# Altium schematic sheet MainSheet.SchDoc
size A4
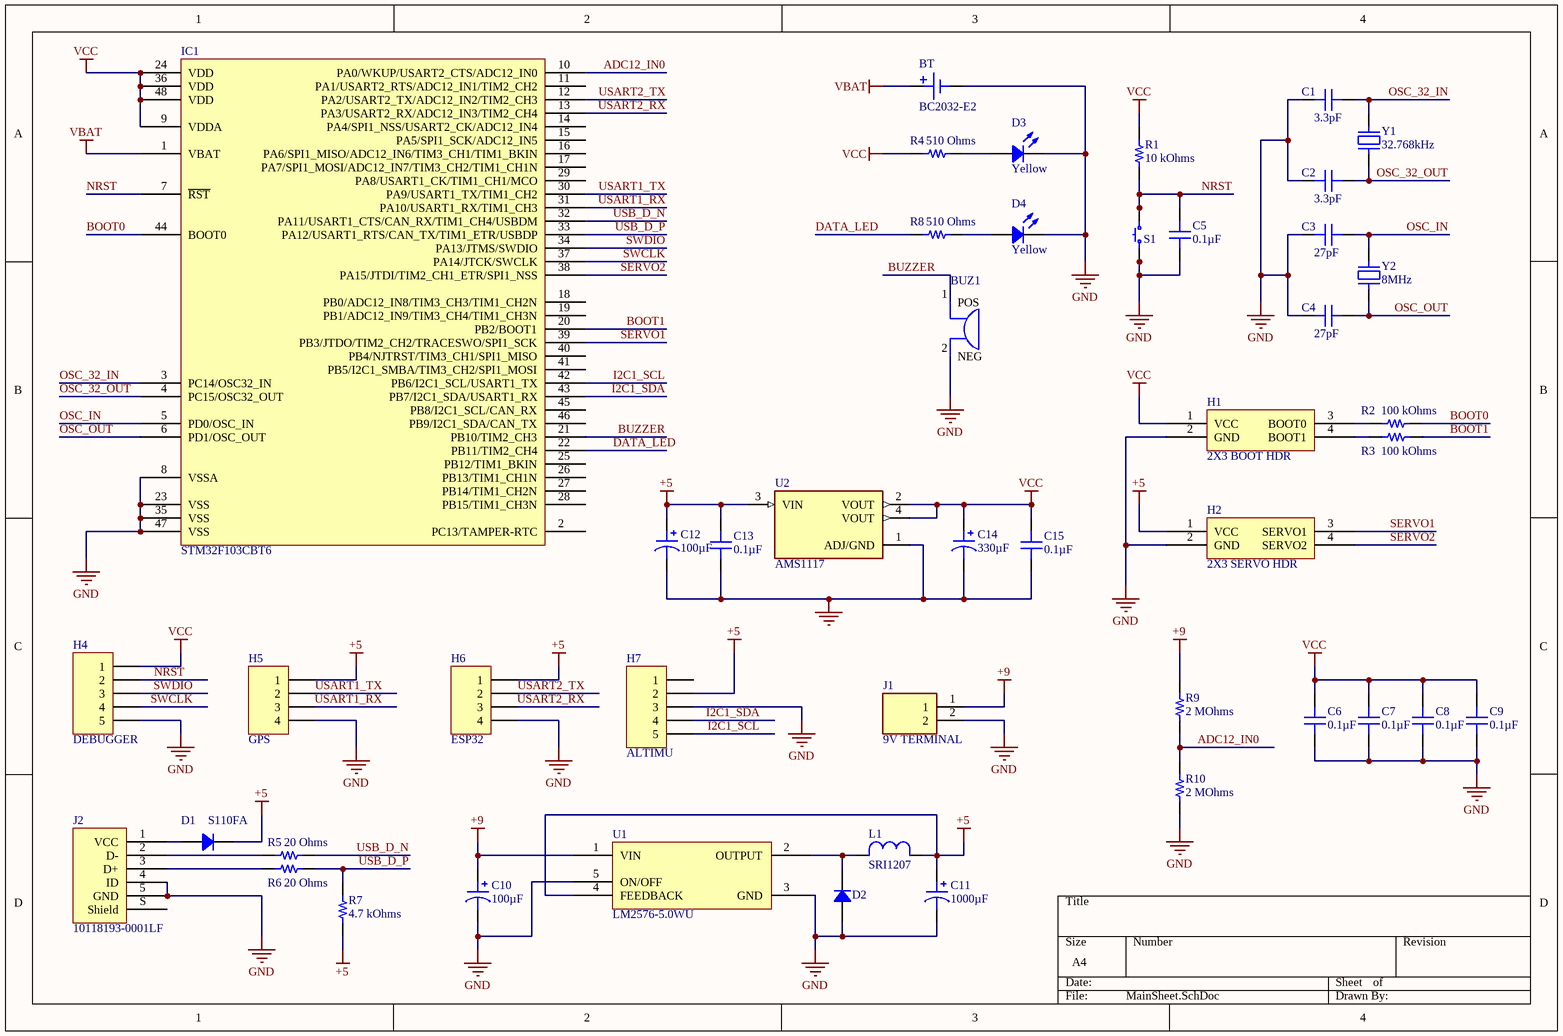
[diagram p0: MainSheet.SchDoc]

## Parts
BT  BC2032-E2  [MPD_BC2032-E2]
BUZ1  MCKPM-G1201A-K4037  [XDCR_MCKPM-G1201A-K4037]  (value not drawn)
C1  3.3pF  [CAP 0603_1608]
C2  3.3pF  [CAP 0603_1608]
C3  27pF  [CAP 0603_1608]
C4  27pF  [CAP 0603_1608]
C5  0.1µF  [CAP 0603_1608]
C6  0.1µF  [CAP 0603_1608]
C7  0.1µF  [CAP 0603_1608]
C8  0.1µF  [CAP 0603_1608]
C9  0.1µF  [CAP 0603_1608]
C10  100µF  [CAP POL 2917_7343]
C11  1000µF  [CAP POL 2917_7343]
C12  100µF  [CAP POL 2917_7343]
C13  0.1µF  [CAP 0805_2012]
C14  330µF  [CAP POL 2917_7343]
C15  0.1µF  [CAP 0805_2012]
D1  S110FA  [SOD-123W]
D2  B360Q-13-F  [DO214AB SMC]  (value not drawn)
D3  Yellow  [LED 1206_3216 YELLOW]
D4  Yellow  [LED 1206_3216 YELLOW]
H1  2X3 BOOT HDR  [2x3 Male Header]
H2  2X3 SERVO HDR  [2x3 Male Header]
H4  DEBUGGER  [HDR1X5]
H5  GPS  [HDR1X4]
H6  ESP32  [HDR1X4]
H7  ALTIMU  [HDR1X5]
IC1  STM32F103CBT6  [ST LQFP-48 7X7MM]
J1  9V TERMINAL  [TE_796683-2]
J2  10118193-0001LF  [FCI USB 10118193-0001LF]
L1  SRI1207  [PCBComponent_1]
R1  10 kOhms  [RES 0603_1608]
R2  100 kOhms  [RES 0603_1608]
R3  100 kOhms  [RES 0603_1608]
R4  510 Ohms  [RES 1206_3216]
R5  20 Ohms  [RES 0603_1608]
R6  20 Ohms  [RES 0603_1608]
R7  4.7 kOhms  [RES 0603_1608]
R8  510 Ohms  [RES 1206_3216]
R9  2 MOhms  [RES 1206_3216]
R10  2 MOhms  [RES 1206_3216]
S1  FSM4JSMATR  [TE FSM4JSMA]  (value not drawn)
U1  LM2576-5.0WU  [DPAK6P170_1524X459L254X81N]
U2  AMS1117  [SOT229P700X180-4N]
Y1  32.768kHz  [ABRACON ABS07]
Y2  8MHz  [ABRACON ABLS]

## Nets
+5: C11.1 C12.1 C13.2 D1.2 H2.1(VCC) H5.1 H6.1 H7.2 L1.2 R7.1 U1.4(FEEDBACK) U2.3(VIN)
+9: C10.1 J1.1 R9.2 U1.1(VIN)
GND: BT.N BUZ1.2(NEG) C1.1 C2.1 C3.2 C4.2 C5.1 C6.1 C7.1 C8.1 C9.1 C10.2 C11.2 C12.2 C13.1 C14.2 C15.1 D2.1 D3.2 D4.2 H1.2(GND) H2.2(GND) H4.5 H5.4 H6.4 H7.3 IC1.8(VSSA) IC1.23(VSS) IC1.35(VSS) IC1.47(VSS) J1.2 J2.4(ID) J2.5(GND) R10.1 S1.1 S1.2 U1.3(GND) U1.5(ON/OFF) U2.1(ADJ/GND)
VBAT: BT.P IC1.1(VBAT)
VCC: C6.2 C7.2 C8.2 C9.2 C14.1 C15.2 H1.1(VCC) H4.1 IC1.9(VDDA) IC1.24(VDD) IC1.36(VDD) IC1.48(VDD) R1.2 R4.1 U2.2(VOUT) U2.4(VOUT)
ADC12_IN0: IC1.10(PA0/WKUP/USART2_CTS/ADC12_IN0) R9.1 R10.2
BOOT0: IC1.44(BOOT0) R2.2
BOOT1: IC1.20(PB2/BOOT1) R3.2
BUZZER: BUZ1.1(POS) IC1.21(PB10/TIM2_CH3)
DATA_LED: IC1.22(PB11/TIM2_CH4) R8.1
I2C1_SCL: H7.5 IC1.42(PB6/I2C1_SCL/USART1_TX)
I2C1_SDA: H7.4 IC1.43(PB7/I2C1_SDA/USART1_RX)
NRST: C5.2 H4.2 IC1.7(~{RST}) R1.1 S1.3 S1.4
OSC_32_IN: C1.2 IC1.3(PC14/OSC32_IN) Y1.2
OSC_32_OUT: C2.2 IC1.4(PC15/OSC32_OUT) Y1.1
OSC_IN: C3.1 IC1.5(PD0/OSC_IN) Y2.2
OSC_OUT: C4.1 IC1.6(PD1/OSC_OUT) Y2.1
SERVO1: H2.3(SERVO1) IC1.39(PB3/JTDO/TIM2_CH2/TRACESWO/SPI1_SCK)
SERVO2: H2.4(SERVO2) IC1.38(PA15/JTDI/TIM2_CH1_ETR/SPI1_NSS)
SWCLK: H4.4 IC1.37(PA14/JTCK/SWCLK)
SWDIO: H4.3 IC1.34(PA13/JTMS/SWDIO)
USART1_RX: H5.3 IC1.31(PA10/USART1_RX/TIM1_CH3)
USART1_TX: H5.2 IC1.30(PA9/USART1_TX/TIM1_CH2)
USART2_RX: H6.3 IC1.13(PA3/USART2_RX/ADC12_IN3/TIM2_CH4)
USART2_TX: H6.2 IC1.12(PA2/USART2_TX/ADC12_IN2/TIM2_CH3)
USB_D_N: IC1.32(PA11/USART1_CTS/CAN_RX/TIM1_CH4/USBDM) R5.2
USB_D_P: IC1.33(PA12/USART1_RTS/CAN_TX/TIM1_ETR/USBDP) R6.2 R7.2
NetD1_1: D1.1 J2.1(VCC)
NetD2_2: D2.2 L1.1 U1.2(OUTPUT)
NetD3_1: D3.1 R4.2
NetD4_1: D4.1 R8.2
NetH1_3: H1.3(BOOT0) R2.1
NetH1_4: H1.4(BOOT1) R3.1
NetJ2_2: J2.2(D-) R5.1
NetJ2_3: J2.3(D+) R6.1

Not connected (* = marked no-connect by the designer): H7 1; IC1 2(PC13/TAMPER-RTC) 11(PA1/USART2_RTS/ADC12_IN1/TIM2_CH2) 14(PA4/SPI1_NSS/USART2_CK/ADC12_IN4) 15(PA5/SPI1_SCK/ADC12_IN5) 16(PA6/SPI1_MISO/ADC12_IN6/TIM3_CH1/TIM1_BKIN) 17(PA7/SPI1_MOSI/ADC12_IN7/TIM3_CH2/TIM1_CH1N) 18(PB0/ADC12_IN8/TIM3_CH3/TIM1_CH2N) 19(PB1/ADC12_IN9/TIM3_CH4/TIM1_CH3N) 25(PB12/TIM1_BKIN) 26(PB13/TIM1_CH1N) 27(PB14/TIM1_CH2N) 28(PB15/TIM1_CH3N) 29(PA8/USART1_CK/TIM1_CH1/MCO) 40(PB4/NJTRST/TIM3_CH1/SPI1_MISO) 41(PB5/I2C1_SMBA/TIM3_CH2/SPI1_MOSI) 45(PB8/I2C1_SCL/CAN_RX) 46(PB9/I2C1_SDA/CAN_TX); J2 S(Shield)

## Library data of the parts
BT = BC2032-E2: BATTERY HOLDER COIN 20MM PC PIN; MF: MPD _Memory; Package: None; Value: *; Price: None; MP: BC2032-E2; Availability: Unavailable; SnapEDA_Link: https://www.snapeda.com/parts/BC2032-E2/MPD%20%28Memory%20Protection%20Devices%29/view-part/4219598/?ref=snap
BUZ1 = MCKPM-G1201A-K4037: Magnetic Buzzer & Transducer MCKPM-G1201A-K4037 /; MF: Multicomp; Value: *; SnapEDA_Link: https://www.snapeda.com/parts/MCKPM-G1201A-K4037/Multicomp/view-part/231709/?ref=snap; Package: None; MP: MCKPM-G1201A-K4037; Availability: Unavailable; Price: None
C1 C2 = 06035U3R3CAT2A: CAP CER 3.3PF 50V NP0 0603; Manufacturer: AVX Corporation; Temperature Coefficient: C0G, NP0; Tolerance: ±0.25pF; Part Number: 06035U3R3CAT2A; Value: 3.3pF; Applications: RF, Microwave, High Frequency; Capacitance: 3.3pF; ComponentLink1Description: Datasheet; ComponentLink1URL: http://datasheets.avx.com/U-Series.pdf; ComponentLink2Description: DigiKey Link; ComponentLink2URL: http://digikey.com/product-detail/en/avx-corporation/06035U3R3CAT2A/478-12739-1-ND/9949267; Device Package: 0603 (1608 Metric); Features: Ultra Low ESR; LastUpdated: 2.09.2020 01:03:19; Lifecycle Status: Active; Minimum Order: 1; Mounting Type: Surface Mount, MLCC; Operating Temperature: -55°C ~ 125°C; Package / Case: 0603 (1608 Metric); Packaging: TapeAndReel; PartId: 11763; Part Status: Active; Price: 0.06; Series: U; Size / Dimension: 0.060" L x 0.030" W (1.52mm x 0.76mm); Supplier 1: DigiKey; Supplier Part Number 1: 478-12739-1-ND; Thickness (Max): 0.036" (0.91mm); Voltage - Rated: 50V
C3 C4 = 600S270FW250XT: CAP CER 27PF 250V NP0 0603; Manufacturer: American Technical Ceramics; Temperature Coefficient: C0G, NP0; Tolerance: ±1%; Part Number: 600S270FW250XT; Value: 27pF; Applications: RF, Microwave, High Frequency, Bypass, Decoupling; Capacitance: 27pF; ComponentLink1Description: Datasheet; ComponentLink1URL: http://www.atceramics.com/UserFiles/600s.pdf; ComponentLink2Description: DigiKey Link; ComponentLink2URL: http://digikey.com/product-detail/en/american-technical-ceramics/600S270FW250XT/1284-1876-1-ND/8269410; Device Package: 0603 (1608 Metric); Features: High Q, Low Loss, Ultra Low ESR; LastUpdated: 2.09.2020 01:03:27; Lifecycle Status: Active; Minimum Order: 1; Mounting Type: Surface Mount, MLCC; Operating Temperature: -55°C ~ 125°C; Package / Case: 0603 (1608 Metric); Packaging: TapeAndReel; PartId: 7201; Part Status: Active; Price: 0.49; Series: ATC 600S; Size / Dimension: 0.063" L x 0.032" W (1.60mm x 0.81mm); Supplier 1: DigiKey; Supplier Part Number 1: 1284-1876-1-ND; Thickness (Max): 0.035" (0.89mm); Voltage - Rated: 250V
C5-C9 = 885012206071: CAP CER 0.1UF 25V X7R 0603; Manufacturer: Würth Elektronik; Tolerance: ±10%; Part Number: 885012206071; Value: 0.1µF; Applications: General Purpose; Capacitance: 0.1µF; ComponentLink1Description: Datasheet; ComponentLink1URL: https://katalog.we-online.de/pbs/datasheet/885012206071.pdf; ComponentLink2Description: DigiKey Link; ComponentLink2URL: http://digikey.com/product-detail/en/w-rth-elektronik/885012206071/732-7989-1-ND/5454616; Device Package: 0603 (1608 Metric); LastUpdated: 2.09.2020 01:03:30; Lifecycle Status: Active; Minimum Order: 1; Mounting Type: Surface Mount, MLCC; Operating Temperature: -55°C ~ 125°C; Package / Case: 0603 (1608 Metric); Packaging: TapeAndReel; PartId: 5665; Part Status: Active; Price: 0.02; Series: WCAP-CSGP; Size / Dimension: 0.063" L x 0.031" W (1.60mm x 0.80mm); Supplier 1: DigiKey; Supplier Part Number 1: 732-7989-1-ND; Temperature Coefficient: X7R; Thickness (Max): 0.037" (0.95mm); Voltage - Rated: 25V
C10 = T495X107K016ATE080: CAP TANT 100UF 10% 16V 2917; Manufacturer: KEMET; Manufacturer Size Code: X; ESR (Equivalent Series Resistance): 80mOhm; Lifetime @ Temp.: 2000 Hrs @ 85°C; Type: Molded; Part Number: T495X107K016ATE080; Value: 100µF; Capacitance: 100µF; ComponentLink1Description: Datasheet; ComponentLink1URL: https://api.kemet.com/component-edge/download/datasheet/T495X107K016ATE080.pdf; ComponentLink2Description: DigiKey Link; ComponentLink2URL: http://digikey.com/product-detail/en/kemet/T495X107K016ATE080/399-10399-1-ND/3880218; Device Package: 2917 (7343 Metric); Features: General Purpose; Height - Seated (Max): 0.169" (4.30mm); LastUpdated: 2.09.2020 01:16:13; Lifecycle Status: Active; Minimum Order: 1; Mounting Type: Surface Mount; Operating Temperature: -55°C ~ 125°C; Package / Case: 2917 (7343 Metric); Packaging: TapeAndReel; PartId: 2918; Part Status: Active; Price: 1.26; Series: T495; Size / Dimension: 0.287" L x 0.169" W (7.30mm x 4.30mm); Supplier 1: DigiKey; Supplier Part Number 1: 399-10399-1-ND; Tolerance: ±10%; Voltage - Rated: 16V
C11 = T491X108K006AT: CAP TANT 1000UF 10% 6.3V 2917; Manufacturer: KEMET; Manufacturer Size Code: X; ESR (Equivalent Series Resistance): 600mOhm; Lifetime @ Temp.: 2000 Hrs @ 125°C; Type: Molded; Part Number: T491X108K006AT; Value: 1000µF; Capacitance: 1000µF; ComponentLink1Description: Datasheet; ComponentLink1URL: https://api.kemet.com/component-edge/download/datasheet/T491X108K006AT.pdf; ComponentLink2Description: DigiKey Link; ComponentLink2URL: http://digikey.com/product-detail/en/kemet/T491X108K006AT/399-5123-1-ND/1681767; Device Package: 2917 (7343 Metric); Features: General Purpose; Height - Seated (Max): 0.169" (4.30mm); LastUpdated: 2.09.2020 01:16:11; Lifecycle Status: Active; Minimum Order: 1; Mounting Type: Surface Mount; Operating Temperature: -55°C ~ 125°C; Package / Case: 2917 (7343 Metric); Packaging: TapeAndReel; PartId: 3349; Part Status: Active; Price: 2.10; Series: T491; Size / Dimension: 0.287" L x 0.169" W (7.30mm x 4.30mm); Supplier 1: DigiKey; Supplier Part Number 1: 399-5123-1-ND; Tolerance: ±10%; Voltage - Rated: 6.3V
C12 = TR3D107K020C0080: CAP TANT 100UF 10% 20V 2917; Manufacturer: Vishay Sprague; Manufacturer Size Code: D; ESR (Equivalent Series Resistance): 80mOhm; Type: Molded; Part Number: TR3D107K020C0080; Value: 100µF; Capacitance: 100µF; ComponentLink1Description: Datasheet; ComponentLink1URL: http://www.vishay.com/docs/40080/tr3.pdf; ComponentLink2Description: DigiKey Link; ComponentLink2URL: http://digikey.com/product-detail/en/vishay-sprague/TR3D107K020C0080/718-1774-1-ND/2260028; Device Package: 2917 (7343 Metric); Features: General Purpose; Height - Seated (Max): 0.122" (3.10mm); LastUpdated: 2.09.2020 01:16:12; Lifecycle Status: Active; Minimum Order: 1; Mounting Type: Surface Mount; Operating Temperature: -55°C ~ 125°C; Package / Case: 2917 (7343 Metric); Packaging: TapeAndReel; PartId: 3089; Part Status: Active; Price: 0.61; Series: TANTAMOUNT®, TR3; Size / Dimension: 0.287" L x 0.169" W (7.30mm x 4.30mm); Supplier 1: DigiKey; Supplier Part Number 1: 718-1774-1-ND; Tolerance: ±10%; Voltage - Rated: 20V
C13 C15 = AC0805KKX8R9BB104: CAP CER 0805 10% X8R 50V 100NF; Manufacturer: Yageo; Part Number: AC0805KKX8R9BB104; Value: 0.1µF; Applications: Automotive; Capacitance: 0.1µF; ComponentLink1Description: Datasheet; ComponentLink1URL: http://www.yageo.com/documents/recent/AC0805KKX8R9BB104.pdf; ComponentLink2Description: DigiKey Link; ComponentLink2URL: http://digikey.com/product-detail/en/yageo/AC0805KKX8R9BB104/311-4624-1-ND/9699550; Device Package: 0805 (2012 Metric); LastUpdated: 2.09.2020 01:04:20; Lifecycle Status: Active; Minimum Order: 1; Mounting Type: Surface Mount, MLCC; Operating Temperature: -55°C ~ 150°C; Package / Case: 0805 (2012 Metric); Packaging: TapeAndReel; PartId: 14076; Part Status: Active; Price: 0.06; Ratings: AEC-Q200; Series: AC; Size / Dimension: 0.079" L x 0.049" W (2.00mm x 1.25mm); Supplier 1: DigiKey; Supplier Part Number 1: 311-4624-1-ND; Temperature Coefficient: X8R; Thickness (Max): 0.057" (1.45mm); Tolerance: ±10%; Voltage - Rated: 50V
C14 = T494D337K006AT: CAP TANT 330UF 10% 6.3V 2917; Manufacturer: KEMET; Manufacturer Size Code: D; ESR (Equivalent Series Resistance): 150mOhm; Lifetime @ Temp.: 2000 Hrs @ 125°C; Type: Molded; Part Number: T494D337K006AT; Value: 330µF; Capacitance: 330µF; ComponentLink1Description: Datasheet; ComponentLink1URL: https://api.kemet.com/component-edge/download/datasheet/T494D337K006AT.pdf; ComponentLink2Description: DigiKey Link; ComponentLink2URL: http://digikey.com/product-detail/en/kemet/T494D337K006AT/399-10434-1-ND/3907839; Device Package: 2917 (7343 Metric); Features: General Purpose; Height - Seated (Max): 0.122" (3.10mm); LastUpdated: 2.09.2020 01:16:17; Lifecycle Status: Active; Minimum Order: 1; Mounting Type: Surface Mount; Operating Temperature: -55°C ~ 125°C; Package / Case: 2917 (7343 Metric); Packaging: TapeAndReel; PartId: 2266; Part Status: Active; Price: 2.20; Series: T494; Size / Dimension: 0.287" L x 0.169" W (7.30mm x 4.30mm); Supplier 1: DigiKey; Supplier Part Number 1: 399-10434-1-ND; Tolerance: ±10%; Voltage - Rated: 6.3V
D1 = S110FA: DIODE SCHOTTKY 100V 1A SOD123FA; Manufacturer: ON Semiconductor; Capacitance @ Vr, F: 55pF @ 4V, 1MHz; Current - Reverse Leakage @ Vr: 50µA @ 100V; Speed: Fast Recovery =< 500ns, > 200mA (Io); Voltage - Forward (Vf) (Max) @ If: 800mV @ 1A; Part Number: S110FA; ComponentLink1Description: Datasheet; ComponentLink1URL: https://www.onsemi.com/pub/Collateral/S110FA-D.pdf; ComponentLink2Description: DigiKey Link; ComponentLink2URL: http://digikey.com/product-detail/en/on-semiconductor/S110FA/S110FACT-ND/5892121; Current - Average Rectified (Io): 1A; Diode Type: Schottky; LastUpdated: 2.09.2020 01:30:30; Lifecycle Status: Active; Minimum Order: 1; Mounting Type: Surface Mount; Operating Temperature - Junction: -55°C ~ 150°C; Package / Case: SOD-123W; Packaging: TapeAndReel; PartId: 3121; Part Status: Active; Price: 0.07; Series: Automotive, AEC-Q101; Supplier 1: DigiKey; Supplier Part Number 1: S110FACT-ND; Supplier Device Package: SOD-123FA; Voltage - DC Reverse (Vr) (Max): 100V
D2 = B360Q-13-F: DIODE SCHOTTKY 60V 3A SMC; Manufacturer: Diodes Incorporated; Capacitance @ Vr, F: 200pF @ 4V, 1MHz; Current - Reverse Leakage @ Vr: 500µA @ 60V; Speed: Fast Recovery =< 500ns, > 200mA (Io); Voltage - Forward (Vf) (Max) @ If: 700mV @ 3A; Part Number: B360Q-13-F; ComponentLink1Description: Datasheet; ComponentLink1URL: https://www.diodes.com/assets/Datasheets/B320Q-B360Q.pdf; ComponentLink2Description: DigiKey Link; ComponentLink2URL: http://digikey.com/product-detail/en/diodes-incorporated/B360Q-13-F/B360Q-13-FDICT-ND/6012769; Current - Average Rectified (Io): 3A; Diode Type: Schottky; LastUpdated: 2.09.2020 01:18:57; Lifecycle Status: Active; Minimum Order: 1; Mounting Type: Surface Mount; Operating Temperature - Junction: -55°C ~ 150°C; Package / Case: DO-214AB, SMC; Packaging: TapeAndReel; PartId: 1652; Part Status: Active; Price: 0.16; Series: Automotive, AEC-Q101; Supplier 1: DigiKey; Supplier Part Number 1: B360Q-13-FDICT-ND; Supplier Device Package: SMC; Voltage - DC Reverse (Vr) (Max): 60V
D3 D4 = FKY1105W-TR: LED YELLOW CLEAR SMD; Manufacturer: Stanley Electric Co; Configuration: Standard; Current - Test: 20mA; Lens Color: Colorless; Lens Size: 1.60mm Dia; Lens Style: Round with Domed Top; Millicandela Rating: 2850mcd; Voltage - Forward (Vf) (Typ): 2.2V; Wavelength - Dominant: 589nm; Wavelength - Peak: 595nm; Part Number: FKY1105W-TR; Color: Yellow; ComponentLink1Description: Datasheet; ComponentLink1URL: http://www.stanley-components.com/php/downloaddatafile.php?rp=0,FKY1105W-TR_e.pdf; ComponentLink2Description: DigiKey Link; ComponentLink2URL: http://digikey.com/product-detail/en/stanley-electric-co/FKY1105W-TR/404-1272-1-ND/9477277; Device Package: 1206 (3216 Metric); Height (Max): 2.05mm; LastUpdated: 2.09.2020 01:21:25; Lens Transparency: Clear; Lifecycle Status: Active; Minimum Order: 1; Mounting Type: Surface Mount; Package / Case: 1206 (3216 Metric); Packaging: TapeAndReel; PartId: 35; Part Status: Active; Price: 0.14; Series: 1105W; Size / Dimension: 3.20mm L x 1.60mm W; Supplier 1: DigiKey; Supplier Part Number 1: 404-1272-1-ND; Supplier Device Package: 3216 (1206); Value: Yellow
H1 H2 = 2X3 BOOT HDR: 2x3 2.54mm Male Header
H4 H7 = Header 5: 1x5 2.54mm Male Header; LatestRevisionDate: 17-Jul-2002; LatestRevisionNote: Re-released for DXP Platform.; Publisher: Altium Limited
H5 H6 = Header 4: 1x4 2.54mm Male Header; LatestRevisionDate: 17-Jul-2002; LatestRevisionNote: Re-released for DXP Platform.; Publisher: Altium Limited
IC1 = STM32F103CBT6: IC MCU 32BIT 128KB FLASH 48LQFP; Manufacturer: STMicroelectronics; Connectivity: CANbus, I²C, IrDA, LINbus, SPI, UART/USART, USB; Core Processor: ARM® Cortex®-M3; Core Size: 32-Bit; Data Converters: A/D 10x12b; Number of I/O: 37; Oscillator Type: Internal; Peripherals: DMA, Motor Control PWM, PDR, POR, PVD, PWM, Temp Sensor, WDT; Program Memory Size: 128KB (128K x 8); RAM Size: 20K x 8; Speed: 72MHz; Voltage - Supply (Vcc/Vdd): 2V ~ 3.6V; Part Number: STM32F103CBT6; ComponentLink1Description: Datasheet; ComponentLink1URL: https://www.st.com/resource/en/datasheet/stm32f103cb.pdf; ComponentLink2Description: DigiKey Link; ComponentLink2URL: http://digikey.com/product-detail/en/stmicroelectronics/STM32F103CBT6/497-6288-ND/1754420; Device Package: 48-LQFP; LastUpdated: 24.05.2020 22:49:18; Lifecycle Status: Active; Minimum Order: 1; Mounting Type: Surface Mount; Operating Temperature: -40°C ~ 85°C (TA); Package / Case: 48-LQFP; Packaging: Tray; PartId: 194; Part Status: Active; Price: 5.25; Program Memory Type: FLASH; Series: STM32F1; Supplier 1: DigiKey; Supplier Part Number 1: 497-6288-ND
J1 = 796683-2: Wire to Board 2 Position 5 mm Pitch 30-12 AWG Euro Style Terminal Block; MF: TE Connectivity; SnapEDA_Link: https://www.snapeda.com/parts/796683-2/TE%20Connectivity/view-part/2873073/?ref=snap; Availability: Unavailable; Price: None; Package: None; TE_purchase_URL: https://www.te.com/usa-en/product-796683-2.html?te_bu=Cor&te_type=disp&te_campaign=seda_glo_cor-seda-global-disp-prtnr-fy19-seda-model-bom-cta_sma-317_1&elqCampaignId=32493; MP: 796683-2; Value: *
J2 = 10118193-0001LF: CONN RCPT USB2.0 MICRO B SMD R/A; Manufacturer: Amphenol ICC (FCI); Connector Type: USB - micro B; Current Rating (Amps): 1.8A per Contact; Gender: Receptacle; Mating Cycles: 10000; Number of Contacts: 5; Number of Ports: 1; Shielding: Shielded; Voltage - Rated: 100VAC; Part Number: 10118193-0001LF; ComponentLink1Description: Datasheet; ComponentLink1URL: https://cdn.amphenol-icc.com/media/wysiwyg/files/documentation/datasheet/inputoutput/io_usb_micro.pdf; ComponentLink2Description: DigiKey Link; ComponentLink2URL: //digikey.com/product-detail/en/amphenol-icc-fci/10118193-0001LF/609-4616-2-ND/2785388; Features: Solder Retention; LastUpdated: 9.12.2019 20:51:28; Lifecycle Status: 0; Minimum Order: 1; Mounting Feature: Horizontal; Mounting Type: Surface Mount, Right Angle; Through Hole; Operating Temperature: -30°C ~ 80°C; Packaging: TapeAndReel; Part Status: Active; Price: 0.21; Series: -; Specifications: USB 2.0; Supplier 1: DigiKey; Supplier Part Number 1: 609-4616-2-ND; Termination: Solder
R1 = RS73F1JTTD1002B: RES 10K OHM 0.1% 1/5W 0603; Manufacturer: KOA Speer Electronics, Inc.; Power (Watts): 0.2W, 1/5W; Temperature Coefficient: ±25ppm/°C; Part Number: RS73F1JTTD1002B; Value: 10 kOhms; ComponentLink1Description: Datasheet; ComponentLink1URL: http://www.koaspeer.com/pdfs/RS73.pdf; ComponentLink2Description: DigiKey Link; ComponentLink2URL: http://digikey.com/product-detail/en/koa-speer-electronics-inc/RS73F1JTTD1002B/2019-RS73F1JTTD1002BCT-ND/11594458; Composition: Thick Film; Device Package: 0603 (1608 Metric); Features: Automotive AEC-Q200, Moisture Resistant; LastUpdated: 2.09.2020 01:09:22; Lifecycle Status: Active; Minimum Order: 1; Number of Terminations: 2; Operating Temperature: -55°C ~ 155°C; Package / Case: 0603 (1608 Metric); Packaging: Unknown; PartId: 56378; Part Status: Active; Price: 0.08; Ratings: AEC-Q200; Resistance: 10 kOhms; Series: RS73; Supplier 1: DigiKey; Supplier Part Number 1: 2019-RS73F1JTTD1002BCT-ND; Supplier Device Package: 0603; Tolerance: ±0.1%
R2 R3 = MCT06030D1003DP500: RES SMD 100K OHM 0.5% 1/8W 0603; Manufacturer: Vishay Beyschlag; Power (Watts): 0.125W, 1/8W; Temperature Coefficient: ±25ppm/°C; Part Number: MCT06030D1003DP500; Value: 100 kOhms; ComponentLink1Description: Datasheet; ComponentLink1URL: http://www.vishay.com/docs/28705/mcx0x0xpro.pdf; ComponentLink2Description: DigiKey Link; ComponentLink2URL: http://digikey.com/product-detail/en/vishay-beyschlag/MCT06030D1003DP500/749-1697-1-ND/7348005; Composition: Thin Film; Device Package: 0603 (1608 Metric); Features: Anti-Sulfur; Height - Seated (Max): 0.022" (0.55mm); LastUpdated: 2.09.2020 01:10:10; Lifecycle Status: Active; Minimum Order: 1; Number of Terminations: 2; Operating Temperature: -55°C ~ 155°C; Package / Case: 0603 (1608 Metric); Packaging: TapeAndReel; PartId: 12060; Part Status: Active; Price: 0.05; Resistance: 100 kOhms; Series: MCT - Professional; Size / Dimension: 0.061" L x 0.033" W (1.55mm x 0.85mm); Supplier 1: DigiKey; Supplier Part Number 1: 749-1697-1-ND; Supplier Device Package: 0603; Tolerance: ±0.5%
R4 R8 = RK73H2BTTD5100F: RES 510 OHM 1% 1/4W 1206; Manufacturer: KOA Speer Electronics, Inc.; Power (Watts): 0.25W, 1/4W; Temperature Coefficient: ±100ppm/°C; Part Number: RK73H2BTTD5100F; ComponentLink1Description: Datasheet; ComponentLink1URL: http://www.koaspeer.com/catimages/Products/RK73H/RK73H.pdf; ComponentLink2Description: DigiKey Link; ComponentLink2URL: http://digikey.com/product-detail/en/koa-speer-electronics-inc/RK73H2BTTD5100F/2019-RK73H2BTTD5100FCT-ND/10237859; Composition: Thick Film; Device Package: 1206 (3216 Metric); Features: Automotive AEC-Q200, Moisture Resistant; Height - Seated (Max): 0.028" (0.70mm); LastUpdated: 2.09.2020 01:12:38; Lifecycle Status: Active; Minimum Order: 1; Number of Terminations: 2; Operating Temperature: -55°C ~ 155°C; Package / Case: 1206 (3216 Metric); Packaging: TapeAndReel; PartId: 40153; Part Status: Active; Price: 0.01; Ratings: AEC-Q200; Resistance: 510 Ohms; Series: RK73H; Size / Dimension: 0.126" L x 0.063" W (3.20mm x 1.60mm); Supplier 1: DigiKey; Supplier Part Number 1: 2019-RK73H2BTTD5100FCT-ND; Supplier Device Package: 1206; Tolerance: ±1%; Value: 510 Ohms
R5 R6 = RP73PF1J20RBTDF: RES SMD 20 OHM 0.1% 1/6W 0603; Manufacturer: TE Connectivity Passive Product; Power (Watts): 0.167W, 1/6W; Temperature Coefficient: ±25ppm/°C; Part Number: RP73PF1J20RBTDF; Value: 20 Ohms; ComponentLink1Description: Datasheet; ComponentLink1URL: https://www.te.com/commerce/DocumentDelivery/DDEController?Action=srchrtrv&DocNm=1773272&DocType=DS&DocLang=English; ComponentLink2Description: DigiKey Link; ComponentLink2URL: http://digikey.com/product-detail/en/te-connectivity-passive-product/RP73PF1J20RBTDF/A109945CT-ND/4034300; Composition: Thin Film; Device Package: 0603 (1608 Metric); Height - Seated (Max): 0.022" (0.55mm); LastUpdated: 2.09.2020 01:09:51; Lifecycle Status: Active; Minimum Order: 1; Number of Terminations: 2; Operating Temperature: -55°C ~ 155°C; Package / Case: 0603 (1608 Metric); Packaging: TapeAndReel; PartId: 20638; Part Status: Active; Price: 0.14; Resistance: 20 Ohms; Series: RP73P, Holsworthy; Size / Dimension: 0.061" L x 0.031" W (1.55mm x 0.80mm); Supplier 1: DigiKey; Supplier Part Number 1: A109945CT-ND; Supplier Device Package: 0603; Tolerance: ±0.1%
R7 = AT0603FRE074K7L: RES SMD 4.7K OHM 1% 1/10W 0603; Manufacturer: Yageo; Power (Watts): 0.1W, 1/10W; Temperature Coefficient: ±50ppm/°C; Part Number: AT0603FRE074K7L; Value: 4.7 kOhms; ComponentLink1Description: Datasheet; ComponentLink1URL: http://www.yageo.com/documents/recent/PYu-AT_51_RoHS_L_5.pdf; ComponentLink2Description: DigiKey Link; ComponentLink2URL: http://digikey.com/product-detail/en/yageo/AT0603FRE074K7L/YAG2130CT-ND/5139578; Composition: Thin Film; Device Package: 0603 (1608 Metric); Features: Anti-Sulfur, Automotive AEC-Q200, Moisture Resistant; Height - Seated (Max): 0.022" (0.55mm); LastUpdated: 2.09.2020 01:10:12; Lifecycle Status: Active; Minimum Order: 1; Number of Terminations: 2; Operating Temperature: -55°C ~ 155°C; Package / Case: 0603 (1608 Metric); Packaging: TapeAndReel; PartId: 11385; Part Status: Active; Price: 0.02; Ratings: AEC-Q200; Resistance: 4.7 kOhms; Series: AT; Size / Dimension: 0.063" L x 0.031" W (1.60mm x 0.80mm); Supplier 1: DigiKey; Supplier Part Number 1: YAG2130CT-ND; Supplier Device Package: 0603; Tolerance: ±1%
R9 R10 = TNPW12062M00BEEN: RES 2M OHM 0.1% 1/4W 1206; Manufacturer: Vishay Dale; Power (Watts): 0.4W, 2/5W; Temperature Coefficient: ±25ppm/°C; Part Number: TNPW12062M00BEEN; ComponentLink1Description: Datasheet; ComponentLink1URL: http://www.vishay.com/docs/28758/tnpw_e3.pdf; ComponentLink2Description: DigiKey Link; ComponentLink2URL: http://digikey.com/product-detail/en/vishay-dale/TNPW12062M00BEEN/541-3864-1-ND/7355222; Composition: Thin Film; Device Package: 1206 (3216 Metric); Features: Anti-Sulfur, Automotive AEC-Q200, Moisture Resistant; Height - Seated (Max): 0.026" (0.65mm); LastUpdated: 2.09.2020 01:12:49; Lifecycle Status: Active; Minimum Order: 1; Number of Terminations: 2; Operating Temperature: -55°C ~ 155°C; Package / Case: 1206 (3216 Metric); Packaging: TapeAndReel; PartId: 35658; Part Status: Active; Price: 0.60; Ratings: AEC-Q200; Resistance: 2 MOhms; Series: TNPW e3; Size / Dimension: 0.126" L x 0.063" W (3.20mm x 1.60mm); Supplier 1: DigiKey; Supplier Part Number 1: 541-3864-1-ND; Supplier Device Package: 1206; Tolerance: ±0.1%; Value: 2 MOhms
S1 = FSM4JSMATR: SWITCH TACTILE SPST-NO 0.05A 24V; Manufacturer: TE Connectivity ALCOSWITCH Switches; Actuator Height off PCB, Vertical: 5.00mm; Actuator Orientation: Top Actuated; Actuator Type: Standard; Contact Rating @ Voltage: 0.05A @ 24VDC; Illumination: Non-Illuminated; Operating Force: 160gf; Outline: 6.00mm x 6.00mm; Switch Function: Off-Mom; Part Number: FSM4JSMATR; Circuit: SPST-NO; ComponentLink1Description: Datasheet; ComponentLink1URL: https://www.te.com/commerce/DocumentDelivery/DDEController?Action=srchrtrv&DocNm=1308111-1_SWITCHES_CORE_PROGRAM_CATALOG&DocType=CS&DocLang=English; ComponentLink2Description: DigiKey Link; ComponentLink2URL: http://digikey.com/product-detail/en/te-connectivity-alcoswitch-switches/FSM4JSMATR/450-1759-1-ND/2271638; LastUpdated: 2.09.2020 01:27:07; Lifecycle Status: Active; Minimum Order: 1; Mounting Type: Surface Mount; Operating Temperature: -35°C ~ 85°C; Packaging: TapeAndReel; Part Status: Active; Price: 0.17; Series: FSMJSMA; Supplier 1: DigiKey; Supplier Part Number 1: 450-1759-1-ND; Termination Style: Gull Wing
U1 = LM2576-5.0WU: Buck Switching Regulator IC Positive Fixed 5V 1 Output 3A TO-263-6, DÂ²Pak _5 Leads + Tab_, TO-263BA; MF: Microchip; Value: *; MP: LM2576-5.0WU; SnapEDA_Link: https://www.snapeda.com/parts/LM2576-5.0WU/Microchip/view-part/104848/?ref=snap; Availability: Unavailable; Package: TO-263-5 Micrel; Price: None
U2 = AMS1117: IC-1117 5V SOT223 T/R SMD AMS; MF: Seeed Technology; Availability: Unavailable; SnapEDA_Link: https://www.snapeda.com/parts/AMS1117/Seeed%20Technology%20Co.%2C%20Ltd/view-part/184428/?ref=snap; MP: AMS1117; Price: None; Value: *; Package: SOT-223 Seeed Technology
Y1 = ABS07-120-32.768KHZ-T: CRYSTAL 32.7680KHZ 6PF SMD; Manufacturer: Abracon LLC; ESR (Equivalent Series Resistance): 55 kOhms; Frequency Tolerance: ±20ppm; Operating Mode: Fundamental; Part Number: ABS07-120-32.768KHZ-T; ComponentLink1Description: Datasheet; ComponentLink1URL: https://abracon.com/Resonators/ABS07-120-32.768kHz-T.pdf; ComponentLink2Description: DigiKey Link; ComponentLink2URL: http://digikey.com/product-detail/en/abracon-llc/ABS07-120-32.768KHZ-T/535-11937-1-ND/3724046; Frequency: 32.768kHz; Height - Seated (Max): 0.035" (0.90mm); LastUpdated: 2.09.2020 01:21:47; Lifecycle Status: Active; Load Capacitance: 6pF; Minimum Order: 1; Mounting Type: Surface Mount; Operating Temperature: -40°C ~ 85°C; Package / Case: 2-SMD, No Lead; Packaging: TapeAndReel; PartId: 385; Part Status: Active; Price: 0.39; Series: ABS07; Size / Dimension: 0.126" L x 0.059" W (3.20mm x 1.50mm); Supplier 1: DigiKey; Supplier Part Number 1: 535-11937-1-ND; Type: kHz Crystal (Tuning Fork); Value: 32.768kHz
Y2 = ABLS-8.000MHZ-B2-T: CRYSTAL 8.0000MHZ 18PF SMD; Manufacturer: Abracon LLC; ESR (Equivalent Series Resistance): 80 Ohms; Frequency Stability: ±50ppm; Frequency Tolerance: ±20ppm; Operating Mode: Fundamental; Part Number: ABLS-8.000MHZ-B2-T; ComponentLink1Description: Datasheet; ComponentLink1URL: https://abracon.com/Resonators/abls.pdf; ComponentLink2Description: DigiKey Link; ComponentLink2URL: http://digikey.com/product-detail/en/abracon-llc/ABLS-8.000MHZ-B2-T/535-9089-1-ND/675606; Frequency: 8MHz; Height - Seated (Max): 0.165" (4.20mm); LastUpdated: 2.09.2020 01:21:45; Lifecycle Status: Active; Load Capacitance: 18pF; Minimum Order: 1; Mounting Type: Surface Mount; Operating Temperature: -20°C ~ 70°C; Package / Case: HC-49/US; Packaging: TapeAndReel; PartId: 133; Part Status: Active; Price: 0.24; Series: ABLS; Size / Dimension: 0.449" L x 0.185" W (11.40mm x 4.70mm); Supplier 1: DigiKey; Supplier Part Number 1: 535-9089-1-ND; Type: MHz Crystal; Value: 8MHz